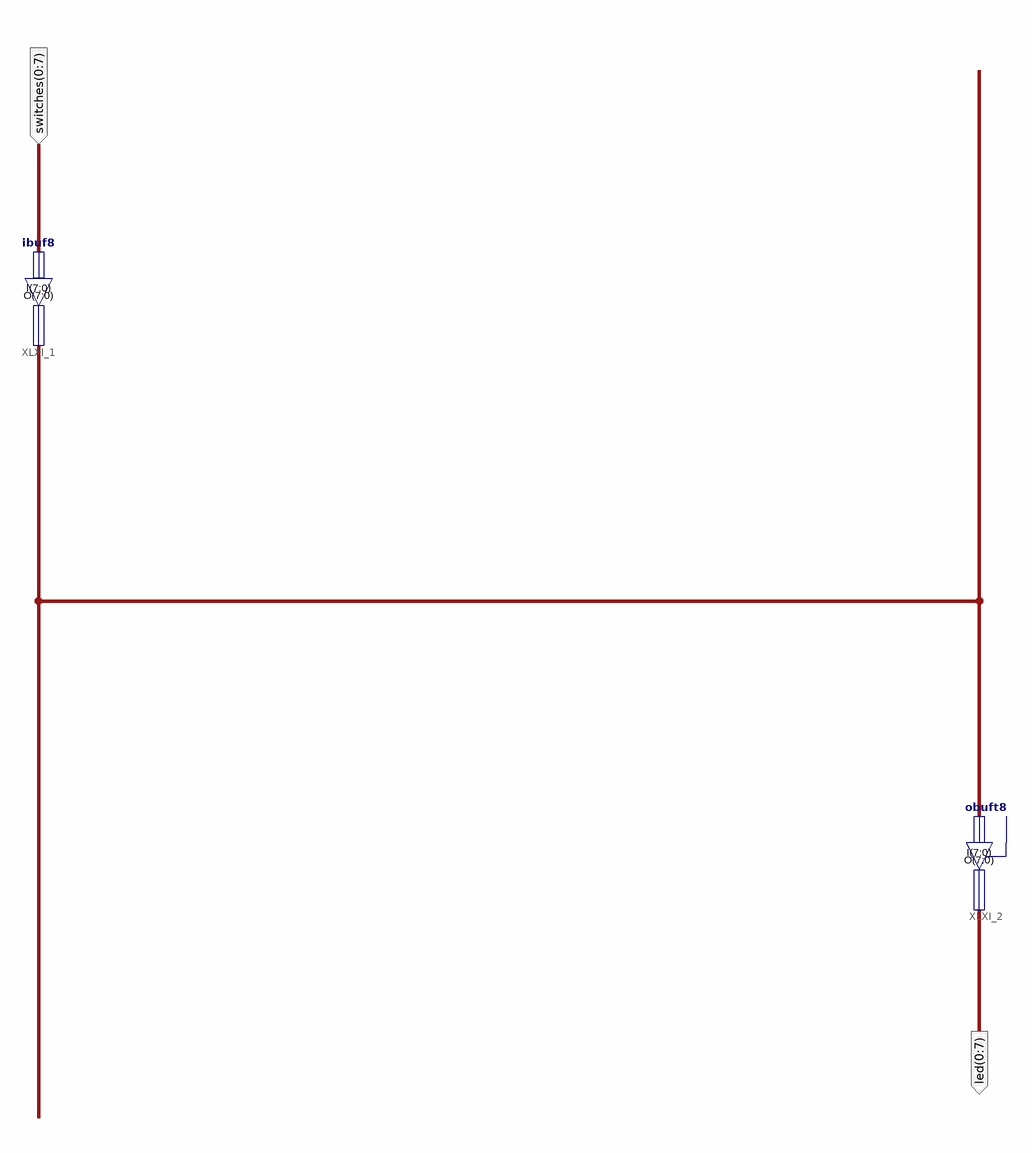
[diagram p0: schematic sheet 1]
// Xilinx ISE schematic toplevel.sch (spartan6) as structural Verilog: 2 symbols, 2 ports
module toplevel (
  input  [0:7] switches,
  output [0:7] led
);

  wire [7:0] XLXN_14;

  ibuf8 XLXI_1 (.I(switches), .O(XLXN_14));
  obuft8 XLXI_2 (.I(XLXN_14), .O(led));  // open: T
endmodule
